# Altium schematic sheet Project_Information.SchDoc: =project_title
size Tabloid; CompanyName: Luxonis Holding; Organization: Luxonis Holding; Address1: 1925 Harmony Park Drive; Address2: Westminster, CO; Address3: 80234; Address4: United States; SheetNumber: 1; SheetTotal: 5
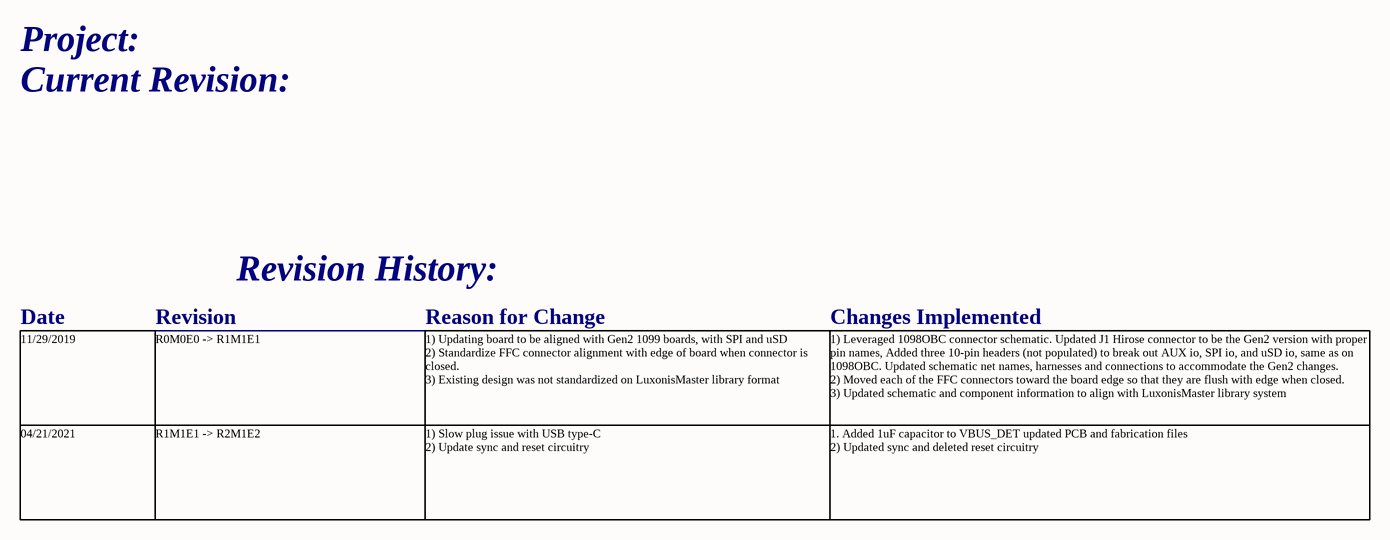
[diagram p0: Project_Information.SchDoc]

## Notes on the sheet
- Project:
- Current Revision:
- Revision History:
- Date
- Revision
- Reason for Change
- Changes Implemented
- 11/29/2019
- R0M0E0 -> R1M1E1
- 1) Updating board to be aligned with Gen2 1099 boards, with SPI and uSD
  2) Standardize FFC connector alignment with edge of board when connector is closed.
  3) Existing design was not standardized on LuxonisMaster library format
- 1) Leveraged 1098OBC connector schematic. Updated J1 Hirose connector to be the Gen2 version with proper pin names, Added three 10-pin headers (not populated) to break out AUX io, SPI io, and uSD io, same as on 1098OBC. Updated schematic net names, harnesses and connections to accommodate the Gen2 changes.
  2) Moved each of the FFC connectors toward the board edge so that they are flush with edge when closed.
  3) Updated schematic and component information to align with LuxonisMaster library system
- 04/21/2021
- R1M1E1 -> R2M1E2
- 1) Slow plug issue with USB type-C
  2) Update sync and reset circuitry
- 1. Added 1uF capacitor to VBUS_DET updated PCB and fabrication files
  2) Updated sync and deleted reset circuitry
- Title
- Size:
- Date:
- Tabloid
- Number:
- Time:
- Revision:
- Sheet
- of
- Drawn by: